# EAGLE schematic NEG_2.5_BOB (EAGLE 7.5.0)
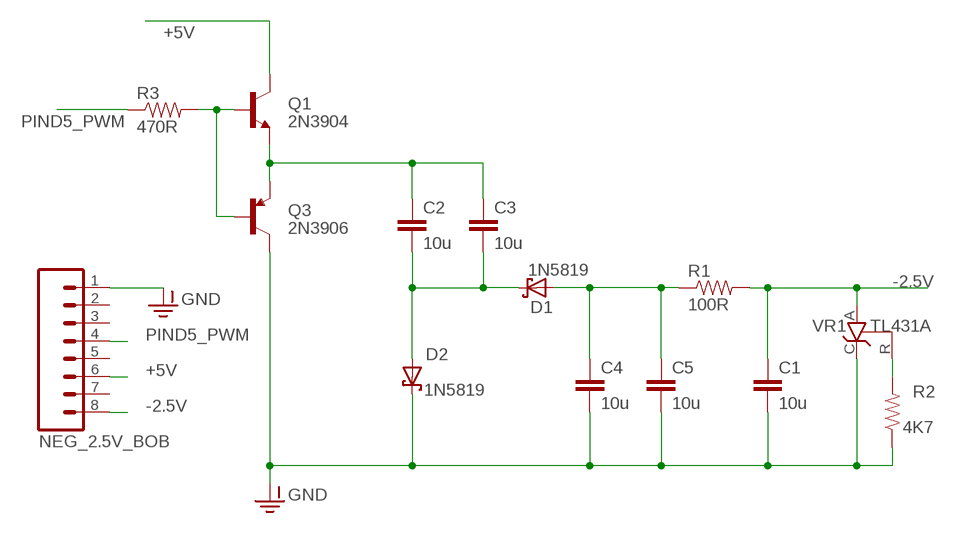
[diagram p0: schematic, sheet 1]

## Parts
C1  10u  CAPPTH1  [CAP-PTH-5MM]
C2  10u  CAPPTH1  [CAP-PTH-5MM]
C3  10u  CAPPTH1  [CAP-PTH-5MM]
C4  10u  CAPPTH1  [CAP-PTH-5MM]
C5  10u  CAPPTH1  [CAP-PTH-5MM]
D1  1N5819  1N5819-B  [DO41-7.6]
D2  1N5819  1N5819-B  [DO41-7.6]
NEG_2.5V_BOB  M08  [1X08_ROUND]
Q1  2N3904  TRANSISTOR_NPN2N3904  [TO-92]
Q3  2N3906  TRANSISTOR_PNPTO92  [TO-92]
R1  100R  RESISTORPTH-1/4W  [AXIAL-0.4]
R2  4K7  RESISTORPTH-1/4W  [AXIAL-0.4]
R3  470R  RESISTORPTH-1/4W  [AXIAL-0.4]
VR1  TL431A  TL431CLP  [TO92-CLP]

## Nets
+5V: NEG_2.5V_BOB.6 Q1.3(C)
-2.5V: C1.1 NEG_2.5V_BOB.8 R1.P$2 VR1.A
GND-ISO: C1.2 C4.2 C5.2 D2.C NEG_2.5V_BOB.1 Q3.3(C) R2.P$1 VR1.C ; supply symbol labelled GND
N$1: C2.1 C3.1 Q1.1(E) Q3.1(E)
N$2: Q1.2(B) Q3.2(B) R3.P$2
N$3: C2.2 C3.2 D1.C D2.A
N$4: C4.1 C5.1 D1.A R1.P$1
N$7: R2.P$2 VR1.R
PIND5_PWM: NEG_2.5V_BOB.4 R3.P$1
Unconnected: NEG_2.5V_BOB.2 NEG_2.5V_BOB.3 NEG_2.5V_BOB.5 NEG_2.5V_BOB.7

## Library data of the parts
C1-C5 = SparkFun-Capacitors:CAP: Capacitor Standard 0603 ceramic capacitor, and 0.1" leaded capacitor.
D1 D2 = diode:1N581*: 1.0A SCHOTTKY BARRIER RECTIFIER Source: http://www.diodes.com/datasheets/ds23001.pdf
NEG_2.5V_BOB = SparkFun-Connectors:M08: Header 8 Standard 8-pin 0.1" header. Use with straight break away headers (SKU : PRT-00116), right angle break away headers (PRT-00553), swiss pins (PRT-00743), machine pins (PRT-00117), and female headers (PRT-00115).
Q1 = SparkFun-DiscreteSemi:TRANSISTOR_NPN: Generic NPN BJT MMBT2222A - TRANS-08049 (SOT-23, 1A 40V) MPSA42 - TRANS-09116 (SOT-23, 500mA 300V) MMBT5088LT1G - TRANS-11160 (SOT-23, 50 mA 30V) BC547 - COM-08928 <http://www.sparkfun.com/products/8928> (TO-92 45V 100mA) (1.Collector 2.Base 3.Emitter) 2N3904 - COM-00521 <http://www.sparkfun.com/products/521> (TO-92 40V 200mA) (1.Emitter 2.Base 3.Collector) P2N2222A - COM-12852 <http://www.sparkfun.com/products/12852> (TO-92 40V 600mA) (1.Collector 2.Base 3.Emitter); PROD_ID: TRANS-08447
Q3 = SparkFun-DiscreteSemi:TRANSISTOR_PNP: Generic PNP BJT Double check pinouts against datasheets- not all devices are the same! MMBT3906 - 40V 200mA SOT-23 (TRANS-08052) MMBT4403 - 40V 600mA SOT-23 (TRANS-09245)
R1-R3 = SparkFun-Resistors:RESISTOR: Resistor Basic schematic elements and footprints for 0603, 1206, and PTH resistors.
VR1 = v-reg:TL431CLP: VOLTAGE REGULATOR